# Altium schematic sheet thermi_mount.SchDoc
size A4; SheetNumber: 2; SheetTotal: 3
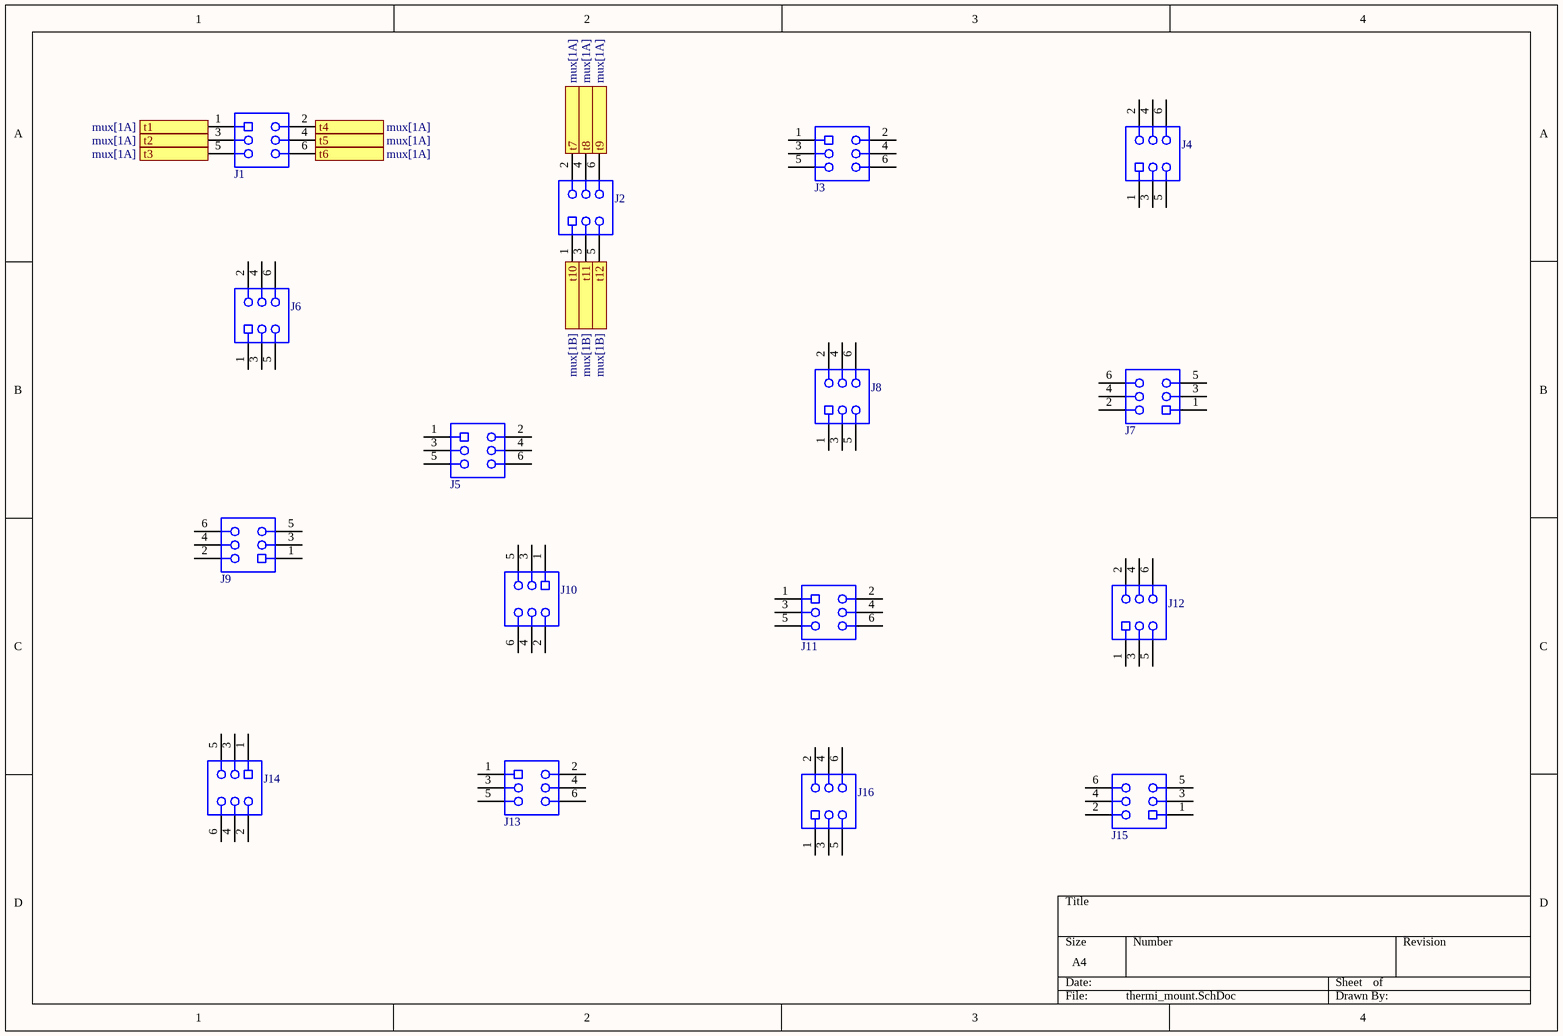
[diagram p0: thermi_mount.SchDoc]

## Parts
J1  610106249221  [610106249221]  (value not drawn)
J2  610106249221  [610106249221]  (value not drawn)
J3  610106249221  [610106249221]  (value not drawn)
J4  610106249221  [610106249221]  (value not drawn)
J5  610106249221  [610106249221]  (value not drawn)
J6  610106249221  [610106249221]  (value not drawn)
J7  610106249221  [610106249221]  (value not drawn)
J8  610106249221  [610106249221]  (value not drawn)
J9  610106249221  [610106249221]  (value not drawn)
J10  610106249221  [610106249221]  (value not drawn)
J11  610106249221  [610106249221]  (value not drawn)
J12  610106249221  [610106249221]  (value not drawn)
J13  610106249221  [610106249221]  (value not drawn)
J14  610106249221  [610106249221]  (value not drawn)
J15  610106249221  [610106249221]  (value not drawn)
J16  610106249221  [610106249221]  (value not drawn)

## Ports
t1 (see mux[1A]), t2 (see mux[1A]), t3 (see mux[1A]), t4 (see mux[1A]), t5 (see mux[1A]), t6 (see mux[1A]), t7 (see mux[1A]), t8 (see mux[1A]), t9 (see mux[1A]), t10 (see mux[1B]), t11 (see mux[1B]), t12 (see mux[1B])

## Nets
t1: J1.1 ; port t1
t2: J1.3 ; port t2
t3: J1.5 ; port t3
t4: J1.2 ; port t4
t5: J1.4 ; port t5
t6: J1.6 ; port t6
t7: J2.2 ; port t7
t8: J2.4 ; port t8
t9: J2.6 ; port t9
t10: J2.1 ; port t10
t11: J2.3 ; port t11
t12: J2.5 ; port t12

Not connected (* = marked no-connect by the designer): J3 1 2 3 4 5 6; J4 1 2 3 4 5 6; J5 1 2 3 4 5 6; J6 1 2 3 4 5 6; J7 1 2 3 4 5 6; J8 1 2 3 4 5 6; J9 1 2 3 4 5 6; J10 1 2 3 4 5 6; J11 1 2 3 4 5 6; J12 1 2 3 4 5 6; J13 1 2 3 4 5 6; J14 1 2 3 4 5 6; J15 1 2 3 4 5 6; J16 1 2 3 4 5 6

## Library data of the parts
J1-J16 = CMP-1502-01387-1: SMT Angled Socket Header WR-PHD, Pitch 2.54 mm, Dual Row, 6 pins; Manufacturer: Wurth Elektronik; Gender: Female; Pin Number: 6; Pitch: 2.54mm; Working Voltage: 250VAC; Withstanding Voltage: 600VAC; Contact Resistance: 20mOhm; Rated Current: 3A; Orientation: Angled; Mounting Technology: SMT; Packaging: TapeandReel; Operating Temperature: -40to105degC; Part Number: 610106249221; Row Number: Dual; Datasheet URL: https://katalog.we-online.de/em/datasheet/6101xx249221.pdf; Manufacturer URL: http://www.we-online.de; Publisher: WurthElektronik; Package Reference: 610106249221